# Altium schematic sheet 15_Clocks_2.SchDoc: Clocks 2
size A4; Organization: Lime Microsystems; Address1: Surrey Tech Centre; Address2: Guildford GU2 7YG; Address3: Surrey; Address4: United Kingdom; Revision: v1.3; SheetNumber: 15; SheetTotal: 16
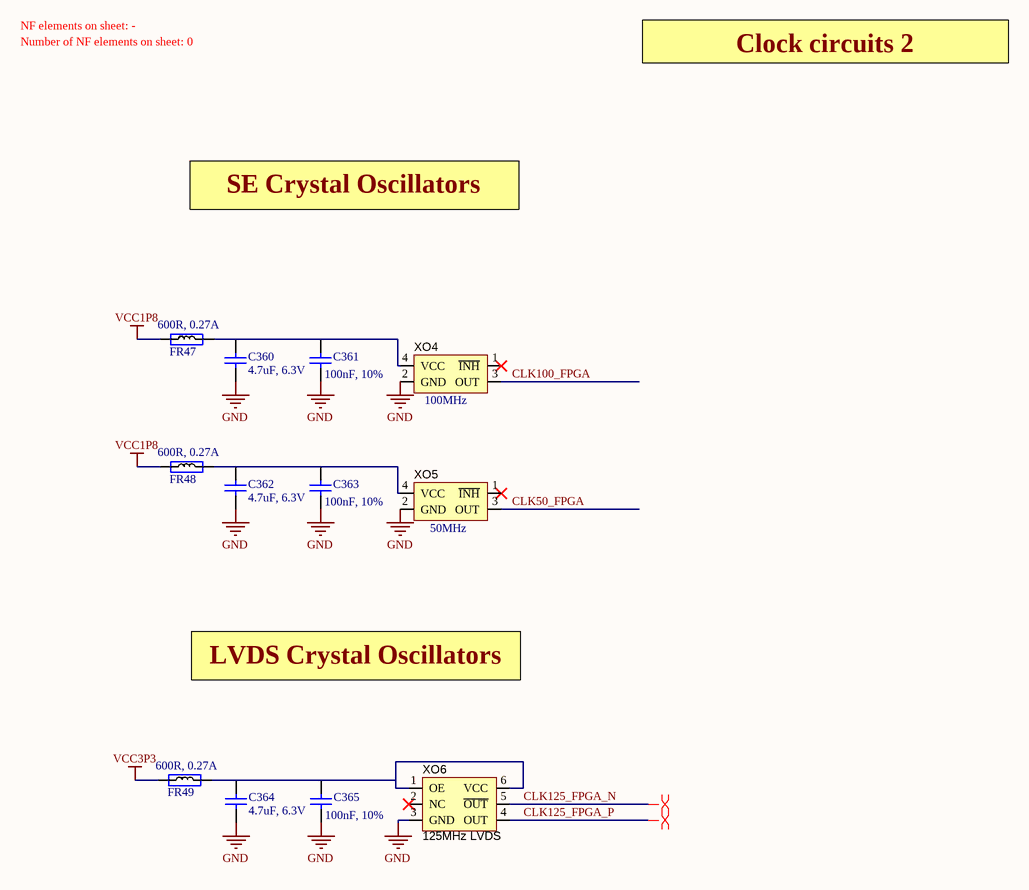
[diagram p0: 15_Clocks_2.SchDoc]

## Parts
C360  4.7uF, 6.3V  [CAP0402]
C361  100nF, 10%  [CAP0402]
C362  4.7uF, 6.3V  [CAP0402]
C363  100nF, 10%  [CAP0402]
C364  4.7uF, 6.3V  [CAP0402]
C365  100nF, 10%  [CAP0402]
FR47  600R, 0.27A  [RES0201]
FR48  600R, 0.27A  [RES0201]
FR49  600R, 0.27A  [RES0201]
XO4  value 100MHz  [CRYSTAL_4-LCC_v4]  (hidden comment: CRYSTAL 100MHz)
XO5  value 50MHz  [CRYSTAL_4-LCC_v4]  (hidden comment: CRYSTAL 50MHz (nr. 1))
XO6  125MHz LVDS  [CRYSTAL_6-LCC]

## Nets
GND: C360.1 C361.2 C362.1 C363.2 C364.1 C365.2 XO4.2(GND) XO5.2(GND) XO6.3(GND)
VCC1P8: FR47.1 FR48.1
VCC3P3: FR49.1
CLK50_FPGA: XO5.3(OUT)
CLK100_FPGA: XO4.3(OUT)
CLK125_FPGA_N: XO6.5(~{OUT})
CLK125_FPGA_P: XO6.4(OUT)
NetC360_2: C360.2 C361.1 FR47.2 XO4.4(VCC)
NetC362_2: C362.2 C363.1 FR48.2 XO5.4(VCC)
NetC364_2: C364.2 C365.1 FR49.2 XO6.1(OE) XO6.6(VCC)

Not connected (* = marked no-connect by the designer): XO4 1(~{INH})*; XO5 1(~{INH})*; XO6 2(NC)*

## Layout directives
differential pair: CLK125_FPGA_N, CLK125_FPGA_P

## Notes on the sheet
- Number of NF elements on sheet: 0
- NF elements on sheet: -
- Clock circuits 2
- SE Crystal Oscillators
- LVDS Crystal Oscillators
- Project name:
- Title:
- Size:
- Date:
- A4
- Revision:
- Time:
- Sheet
- of
- File:

## Library data of the parts
C360 C362 C364 = Cap_0402: Manufacturer Part Number 1: GRM155R60J475ME87D; Manufacturer: Murata Electronics North America; Part Description: 4.7µF ±20% 6.3V X5R Ceramic Capacitor -55°C ~ 85°C Surface Mount, MLCC 0402 (1005 Metric) 0.039" L x 0.020" W (1.00mm x 0.50mm); Temperature Coefficient: X5R; Capacitance: 4.7µF; Tolerance: ±20%; Value: 4.7uF, 6.3V; Supplier 1: Digi-Key; Supplier Part Number 1: 490-5408-1-ND; Category: Capacitors; Voltage - Rated: 6.3V; Thickness (Max): 0.022" (0.55mm); Applications: General Purpose; Package / Case: 0402 (1005 Metric); Size / Dimension: 0.039" L x 0.020" W (1.00mm x 0.50mm); Features: Derating Recommended; Mounting Type: Surface Mount, MLCC; Ratings: -; Lead Style: -; Operating Temperature: -55°C ~ 85°C; Lead Spacing: -; RoHS: RoHS Compliant; Height - Seated (Max): -; Packaging: Cut Tape (CT)
C361 C363 C365 = Cap_0603: Manufacturer Part Number 1: GRM155R71C104KA88D; Part Description: 0.10µF ±10% 16V X7R Ceramic Capacitor -55°C ~ 125°C Surface Mount, MLCC 0402 (1005 Metric) 0.039" L x 0.020" W (1.00mm x 0.50mm); Brand: Murata Electronics; Type: General Purpose MLCC; Capacitance: 0.1 uF; Temperature Coefficient / Code: +/- 15 %; Voltage Rating DC: 16 V; Supplier 1: Mouser; Supplier Part Number 1: 81-GRM155R71C104KA88; Tolerance: 10 %; Case Code - in: 0402; Manufacturer: Murata Electronics; Category: Multilayer Ceramic Capacitors MLCC - SMD/SMT; Value: 100nF, 10%; Manufacturer Part Number: GRM155R71C104KA88D; Maximum Operating Temperature: + 125 C; Minimum Operating Temperature: - 55 C; Minimum Order Quantity: 1; Operating Temperature Range: - 55 C to + 125 C; Package / Case: 0402 (1005 metric); Packaging: Reel; Product: General Type MLCCs; Product Category: Low & Medium Capacitance SMD Ceramic Chip Capacitors; Reeling: True; RoHS - Mouser: Y; RoHS: RoHS Compliant; Series: GRM; Standard Pack Qty: 10000; Termination Style: SMD/SMT
FR47-FR49 = Ferrite: Manufacturer Part Number 1: BK0603TS601-T; Manufacturer: Taiyo Yuden; Part Description: FERRITE BEAD 600 OHM 0201 1LN; DC Resistance (DCR): 750 mOhm Max; Filter Type: Differential Mode - Single; Impedance @ Frequency: 600 Ohm @ 100MHz; Current Rating: 270mA; Supplier 1: Digi-Key; Supplier Part Number 1: 587-3277-1-ND; Size / Dimension: 0.024" L x 0.012" W (0.60mm x 0.30mm); Package / Case: 0201 (0603 Metric); Height (Max): 0.013" (0.33mm); Mounting Type: Surface Mount; Packaging: Cut Tape (CT); RoHS: RoHS Compliant; Category: Filters; Value: 600R, 0.27A
XO4 = CRYSTAL: Oscillator Crystal; Manufacturer Part Number: KC5032A100.000C1GE00; Manufacturer: AVX Corp/Kyocera Corp; Part Description: OSC XO 100.000MHZ CMOS SMD; Current - Supply (Max): 19mA; Current - Supply (Disable) (Max): 10µA; Voltage - Supply: 1.8V, 2.5V, 3.3V; Function: Standby (Power Down); Output: CMOS; Frequency Stability: ±50ppm; Package / Case: 4-SMD, No Lead (DFN, LCC); Mounting Type: Surface Mount; Ratings: -; RoHS: RoHS Compliant; Height: 0.039" (1.00mm); Category: Crystals and Oscillators; Supplier Part Number 1: 1253-1302-1-ND; Supplier 1: Digi-Key; Size / Dimension: 0.197" L x 0.126" W (5.00mm x 3.20mm); Packaging: Cut Tape (CT); Frequency: 100MHz; Operating Temperature: -40°C ~ 85°C; Type: XO (Standard)
XO5 = CRYSTAL: Oscillator Crystal; Manufacturer Part Number: KC5032A50.0000CMGE00; Manufacturer: AVX Corp/Kyocera Corp; Part Description: OSCILLATOR XO 50.000MHZ CMOS SMD; Current - Supply (Disable) (Max): 10µA; Frequency Stability: ±50ppm; Voltage - Supply: 1.8V, 2.5V, 3.3V, 5V; Output: CMOS; Current - Supply (Max): 9.5mA; Function: Standby (Power Down); Package / Case: 4-SMD, No Lead (DFN, LCC); Height: 0.039" (1.00mm); Supplier Part Number 1: 1253-1297-1-ND; Supplier 1: Digi-Key; Packaging: Cut Tape (CT); Category: Crystals and Oscillators; Mounting Type: Surface Mount; RoHS: RoHS Compliant; Frequency: 50MHz; Ratings: -; Type: XO (Standard); Size / Dimension: 0.197" L x 0.126" W (5.00mm x 3.20mm); Operating Temperature: -40°C ~ 85°C
XO6 = CRYSTAL_SG3225: Oscillator Crystal; Manufacturer: EPSON; Manufacturer Part Number 1: SG3225VAN 125.000000M-KEGA3; Part Description: 125MHz LVDS XO (Standard) Oscillator Surface Mount 2.5 V ~ 3.3 V 30mA Enable/Disable; Function: Tri-State (Output Enable); Current - Supply (Max): 30mA; Current - Supply (Disable) (Max): 20mA; Frequency Stability: ±30ppm; Voltage - Supply: 2.5 V ~ 3.3 V; Supplier 1: Digi-Key; Supplier Part Number 1: SER3930CT-ND; Operating Temperature: -40°C ~ 85°C; Packaging: Cut Tape (CT); Mounting Type: Surface Mount; Type: XO (Standard); RoHS: RoHS Compliant; Height: 0.047" (1.20mm); Category: Crystals and Oscillators; Ratings: -; Package / Case: 6-SMD, No Lead (DFN, LCC); Output: LVDS; Size / Dimension: 0.126" L x 0.098" W (3.20mm x 2.50mm); Frequency: 125MHz; Value: 125MHz LVDS